# EAGLE board Calliope mini rev2.1 (EAGLE 9.6.2), part 1 of 2
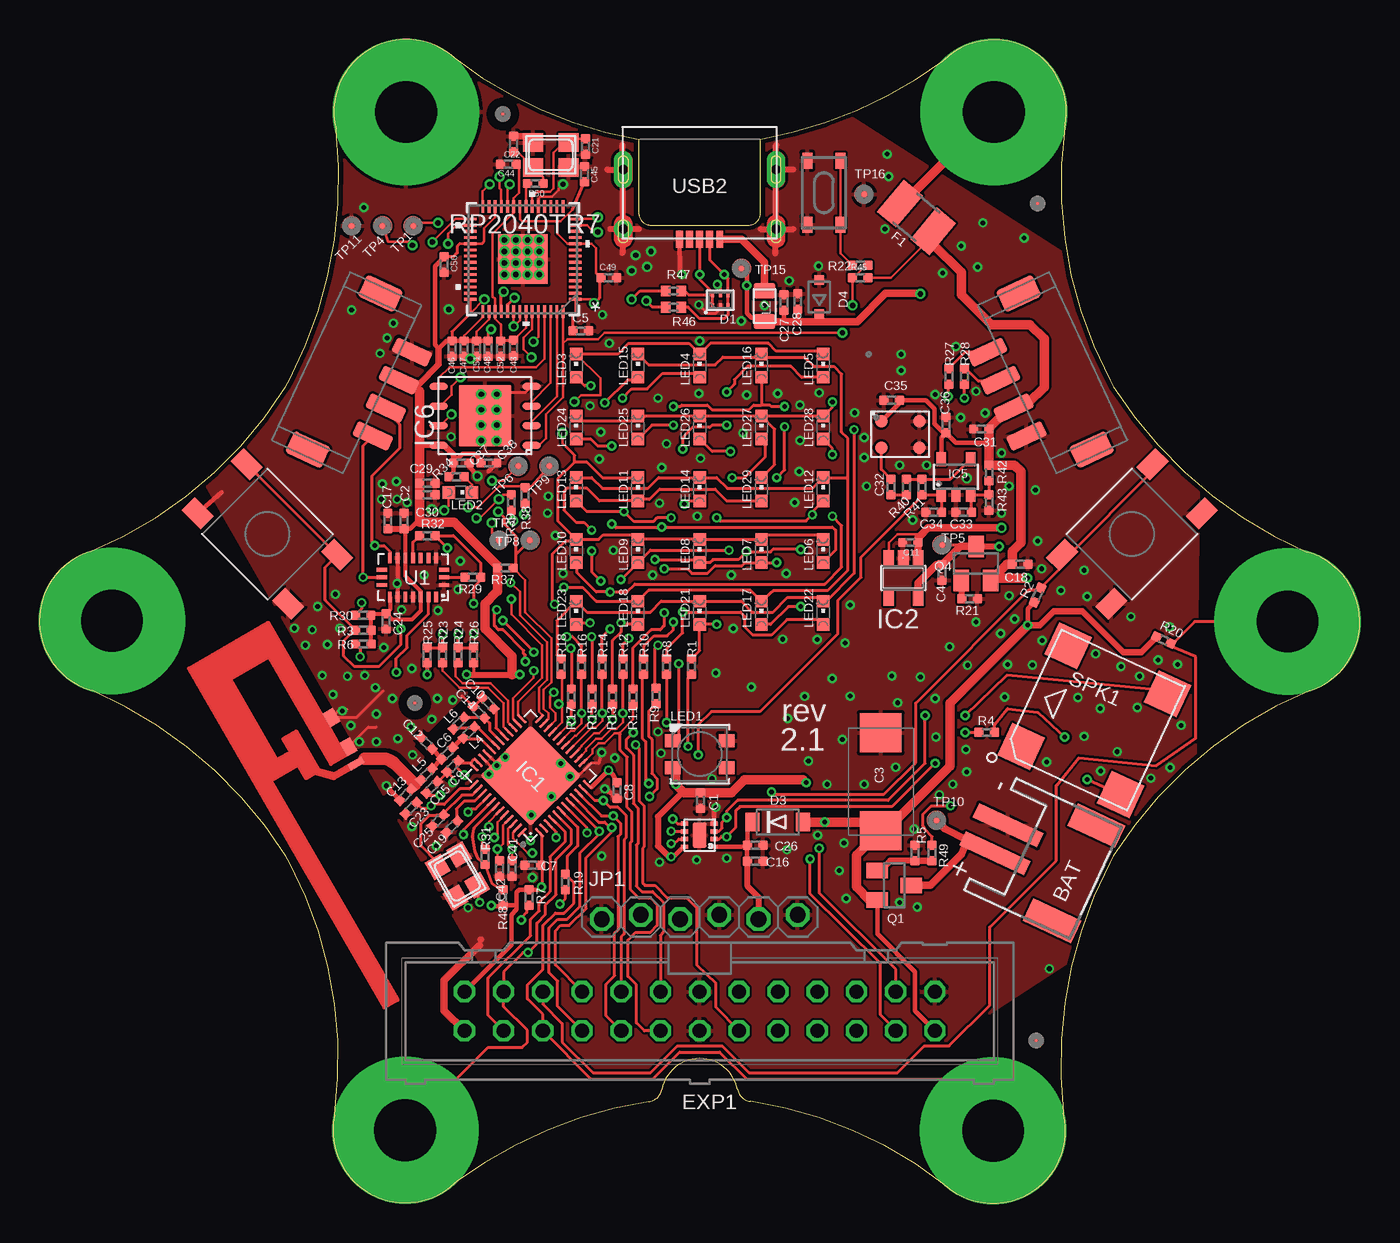
[diagram p3: board, top side]
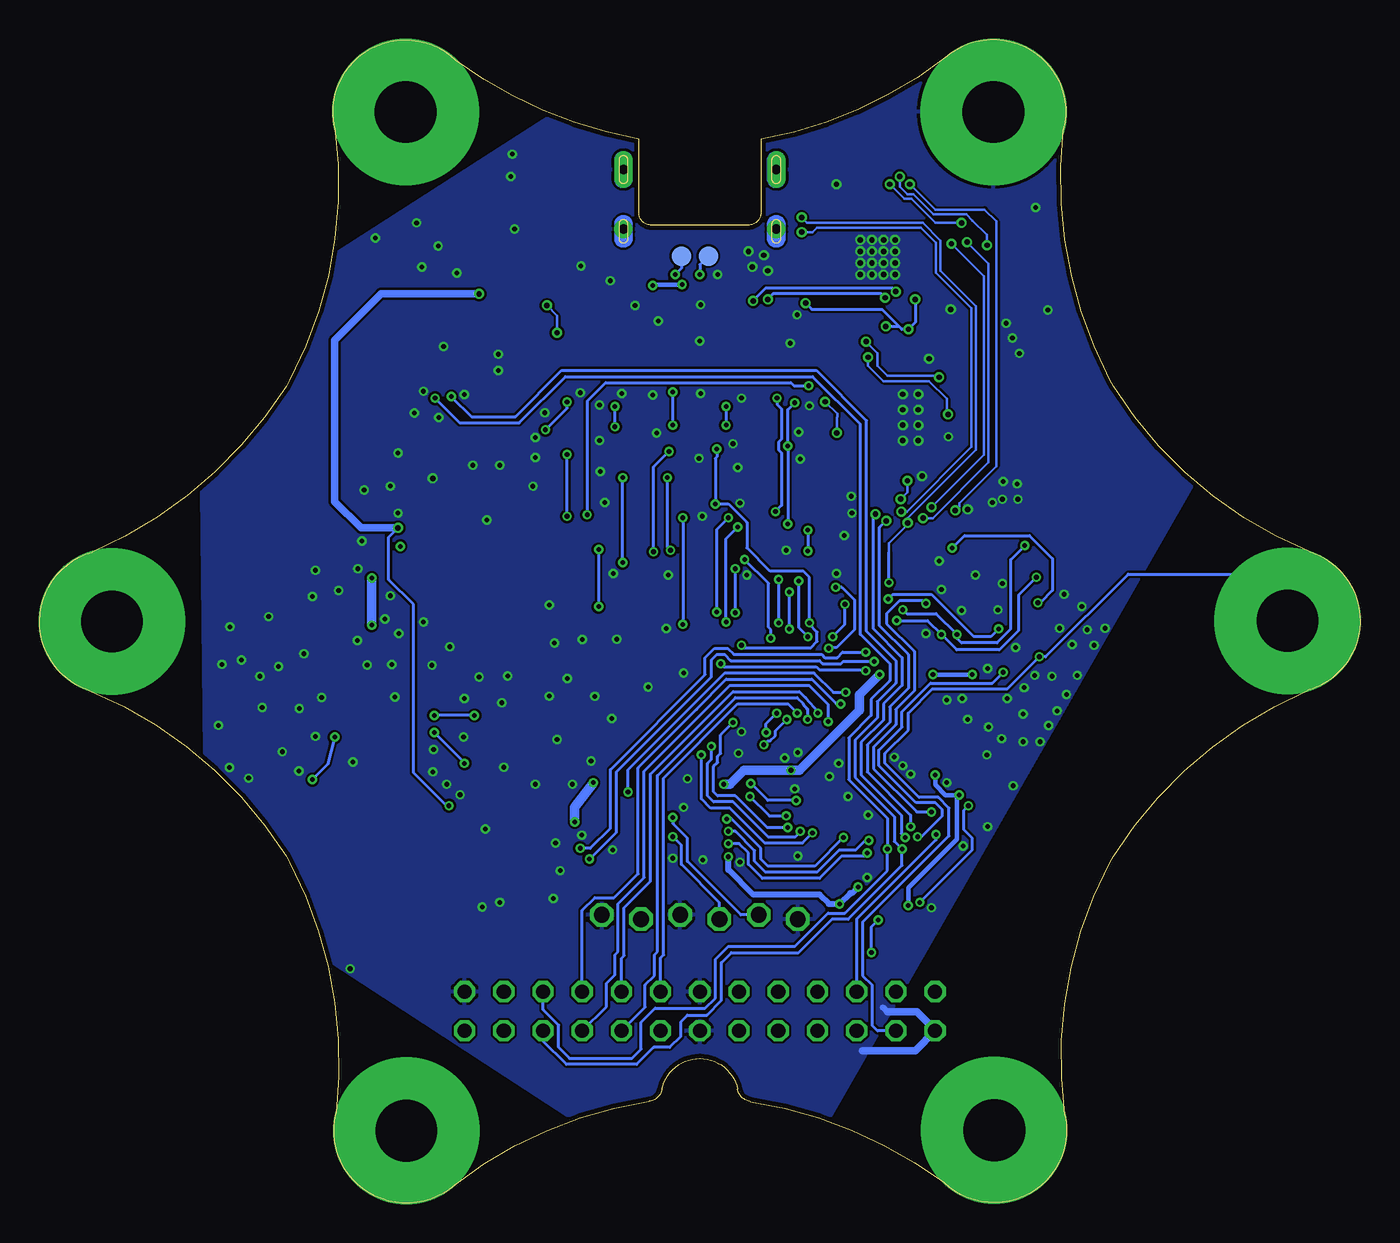
[diagram p4: board, bottom side, seen from below]

Size 85.54 x 75.36 mm. Coordinates in mm from the lower left corner, seen from the top.
Outline: 38.82,68.88 38.82,68.89
Outline: 46.72,64.13 arc-90 45.92,63.33 39.62,63.33 arc-90 38.82,64.13 38.82,68.89 arc-28 26.9,74.16 arc146 19.21,69.54 arc-34 16.21,53.31 15.96,52.87 arc-36 3.25,42.18 arc146 3.4,33.2 arc-34 15.96,22.5 16.21,22.05 arc-36 19.11,5.7 arc146 26.96,1.35 arc-28 39.49,6.57 arc70 40.32,7.36 arc-157 45.22,7.37 arc70 46.05,6.59 arc-29 58.64,1.2 arc146 66.33,5.83 arc-34 69.33,22.05 69.58,22.5 arc-36 82.3,33.18 arc146 82.14,42.16 arc-34 69.58,52.87 69.33,53.31 arc-36 66.43,69.66 arc146 58.58,74.01 arc-26 46.72,68.9 46.72,68.88
Copper layers (1*16): Top 0.035mm / dielectric 1.55mm / Bottom 0.035mm
Design rules "eC_2Layer_PClass6_BaseCopperO35 *": minimum track width 0.15mm, minimum drill 0.3mm, track to track 0.15mm, track to pad 0.15mm, pad to pad 0.15mm, via to via 0.15mm, smd to smd 0mil, copper to edge 0.3mm, drill to drill 0.35mm, minimum pad ring 0.175mm, minimum via ring 0.15mm, stop-mask expansion 0.05mm, vias tented up to drill 0.45mm, thermal gap 0.2mm
tKeepout: area 18,64.9 to 29.5,76.4; area 56.1,64.9 to 67.6,76.4; area 75.1,31.9 to 86.6,43.4; area 56,-1.1 to 67.5,10.4; area 18,-1 to 29.5,10.5; area 35.8,63.9 to 37.8,69.9; area 35.8,62.5 to 37.8,68.5; area 35.8,60.5 to 41.8,62.5; area 41.8,60.5 to 47.8,62.5; area 47.8,60.5 to 49.8,66.5; area 47.8,64.5 to 49.8,70.5; area 48.1,67.7 to 54.1,69.7; area 52.2,63.7 to 54.2,69.7; area 52.2,63.1 to 54.2,69.1; area 48.2,61.1 to 54.2,63.1; area 66.1,23.7 to 72.4,28.1; area 63,25.1 to 69.3,29.5; area 59.6,24.1 to 63.9,30.4; area 57.8,20.4 to 62.2,26.7; area 57,16.9 to 63.3,21.3; area 61.7,14.7 to 68,19.1; area 22.5,5.7 to 28.5,7.7; area 28.5,5.7 to 34.5,7.7; area 34.5,5.7 to 40.5,7.7; area 40.5,5.7 to 46.5,7.7; area 46.5,5.7 to 52.5,7.7; area 52.5,5.7 to 58.5,7.7; area 57.1,5.7 to 63.1,7.7; area 63.1,5.7 to 65.1,11.7; area 63.1,11.7 to 65.1,17.7; area 59.1,16.9 to 65.1,18.9; area 53.1,16.9 to 59.1,18.9; area 47.1,16.9 to 53.1,18.9; area 41.1,16.9 to 47.1,18.9; area 35.1,16.9 to 41.1,18.9; area 29.1,16.9 to 35.1,18.9; area 23.1,16.9 to 29.1,18.9; area 22.4,16.9 to 28.4,18.9; area 20.4,12.9 to 22.4,18.9; area 20.4,6.9 to 22.4,12.9; area 43.1,19.8 to 49.1,21.8; area 49.1,15.8 to 51.1,21.8; area 37.1,19.8 to 43.1,21.8; area 36.4,19.8 to 42.4,21.8; area 34.4,15.8 to 36.4,21.8; area 14.8,37.7 to 20.4,43.4; area 66.5,36.3 to 72.2,41.9; area 70.8,37.7 to 76.4,43.3; area 67.5,46.2 to 73.8,50.6; area 64.1,44.6 to 70.4,49; area 61.5,46.4 to 65.9,52.7; area 59.7,50.2 to 64.1,56.5; area 59,51.8 to 63.3,58.1; area 58.1,57.3 to 64.4,61.6; area 60.8,58.5 to 67.1,62.9; area 65.1,37.7 to 70.8,43.3; area 63.7,41.9 to 69.4,47.6; area 67.5,45.8 to 73.2,51.4; area 73.1,40.1 to 78.8,45.7; area 16.2,42 to 21.8,47.6; area 12.4,45.7 to 18.1,51.4; area 10.5,36.3 to 16.2,42; area 6.6,40.3 to 12.2,45.9; area 19.6,46.4 to 24,52.7; area 15.2,44.6 to 21.5,48.9; area 22.2,51.8 to 26.5,58.1; area 21.1,57.3 to 27.4,61.7; area 18.5,58.6 to 24.8,62.9; area -1,31.9 to 10.5,43.4

## Footprints (pad centres in the part's own frame; a part is rotated, then mirrored left to right if it is on the bottom)
JST-PH-2-SMT-RA = smd 1 x 4.6: 1 1,-3.7; 2 -1,-3.7 | smd 1.6 x 3.4: NC1 -3.4,1.5; NC2 3.4,1.5
0402 = smd 0.6 x 0.6: 1 -0.5,0; 2 0.5,0
D/7343-31R = smd 2.55 x 2.7: + 3.175,0; - -3.175,0
SOT886 = smd 0.325 x 0.27: 1 -0.338,0.5; 2 -0.338,0; 3 -0.338,-0.5; 4 0.338,-0.5; 5 0.338,0; 6 0.338,0.5
SOD-123FL = smd 0.91 x 1.22: A 1.637,0; C -1.637,0
SOD323-R = smd 0.6 x 0.6: A 1.1,0; C -1.1,0
ML26 = drill 0.914 octagon: 1 -15.24,-1.27; 2 -15.24,1.27; 3 -12.7,-1.27; 4 -12.7,1.27; 5 -10.16,-1.27; 6 -10.16,1.27; 7 -7.62,-1.27; 8 -7.62,1.27; 9 -5.08,-1.27; 10 -5.08,1.27; 11 -2.54,-1.27; 12 -2.54,1.27; 13 0,-1.27; 14 0,1.27; 15 2.54,-1.27; 16 2.54,1.27; 17 5.08,-1.27; 18 5.08,1.27; 19 7.62,-1.27; 20 7.62,1.27; 21 10.16,-1.27; 22 10.16,1.27; 23 12.7,-1.27; 24 12.7,1.27; 25 15.24,-1.27; 26 15.24,1.27
R1210 = smd 1.6 x 2.7: 1 -1.4,0; 2 1.4,0
1125S-SMT-XP = smd 1 x 2.5: 1 3,0.325; 2 1,0.325; 3 -1,0.325; 4 -3,0.325 | smd 1.55 x 2.6: P$1 5.575,-3.125; P$2 -5.575,-3.125
QFN48 = smd 0.8 x 0.2: 1 -3,2.2; 2 -3,1.8; 3 -3,1.4; 4 -3,1; 5 -3,0.6; 6 -3,0.2; 7 -3,-0.2; 8 -3,-0.6; 9 -3,-1; 10 -3,-1.4; 11 -3,-1.8; 12 -3,-2.2; 25 3,-2.2; 26 3,-1.8; 27 3,-1.4; 28 3,-1; 29 3,-0.6; 30 3,-0.2; 31 3,0.2; 32 3,0.6; 33 3,1; 34 3,1.4; 35 3,1.8; 36 3,2.2 | smd 0.2 x 0.8: 13 -2.2,-3; 14 -1.8,-3; 15 -1.4,-3; 16 -1,-3; 17 -0.6,-3; 18 -0.2,-3; 19 0.2,-3; 20 0.6,-3; 21 1,-3; 22 1.4,-3; 23 1.8,-3; 24 2.2,-3; 37 2.2,3; 38 1.8,3; 39 1.4,3; 40 1,3; 41 0.6,3; 42 0.2,3; 43 -0.2,3; 44 -0.6,3; 45 -1,3; 46 -1.4,3; 47 -1.8,3; 48 -2.2,3 | smd 4.65 x 4.65: GND 0,0
SOT23-5 = smd 0.69 x 0.99: 1 -0.95,-1.29; 2 0,-1.29; 3 0.95,-1.29; 4 0.95,1.3; 5 -0.95,1.3
WSON8 = smd 0.28 x 0.5: 1 -0.75,-0.925; 2 -0.25,-0.925; 3 0.25,-0.925; 4 0.75,-0.925; 5 0.75,0.975; 6 0.25,0.975; 7 -0.25,0.975; 8 -0.75,0.975 | smd 1.6 x 0.9: EP 0,0
SOT23-5' = smd 0.6 x 0.9: 1 -0.95,-1.15; 2 0,-1.15; 3 0.95,-1.15; 4 0.95,1.15; 5 -0.95,1.15
VQFN8_6X5 = smd 1.2 x 0.45: 1 -3,1.905; 2 -3,0.635; 3 -3,-0.635; 4 -3,-1.905; 5 3,-1.905; 6 3,-0.635; 7 3,0.635; 8 3,1.905 | smd 3.4 x 4: EP 0,0
1X06-OFF = drill 1.016 octagon: 1 -6.35,-0.14; 2 -3.81,0.14; 3 -1.27,-0.14; 4 1.27,0.14; 5 3.81,-0.14; 6 6.35,0.14
FERRIT_0805 = smd 1 x 1.4: 1 -1,0; 2 1,0
LED3535 = smd 1 x 0.85: 1 -1.75,0.875; 2 -1.75,-0.875; 3 1.75,-0.875; 4 1.75,0.875
CHIPLED_0603 = smd 0.8 x 0.8: A 0,-0.75; C 0,0.75
SPU0410HR5H-PB = smd 0.8 x 0.8: 1 0.85,1.23; 2 0.85,-1.23; 3 -0.85,-1.23; 4 -0.85,1.23
BANANA_REC = drill 4 pad 9.5: 1 0,0
SOT23 = smd 1 x 1.4: 1 -0.95,-1.1; 2 0.95,-1.1; 3 0,1.1
NX3225 = smd 1.3 x 1.2: 1 -1.15,-0.8; 2 1.15,-0.8; 3 1.15,0.8; 4 -1.15,0.8
R0402 = smd 0.6 x 0.7: 1 -0.5,0; 2 0.5,0
MLT-8530 = smd 2.3 x 2.3: +LEAD -3.575,3.65; -LEAD -3.575,-3.55; DUMMY1 3.575,3.55; DUMMY2 3.575,-3.65
PTS645S = smd 1.74 x 1.2: 1 -4.145,2.25; 2 4.145,2.25; 3 -4.145,-2.25; 4 4.145,-2.25
PTS810 = smd 1.05 x 0.65: 1 -2.075,1.075; 2 2.075,1.075; 3 -2.075,-1.075; 4 2.075,-1.075
B1,27 = smd 1.27 x 1.27: TP 0,0
BMX055 = smd 0.675 x 0.25: 1 1.262,1.5; 2 1.262,1; 3 1.262,0.5; 4 1.262,0; 5 1.262,-0.5; 6 1.262,-1; 7 1.262,-1.5; 11 -1.262,-1.5; 12 -1.262,-1; 13 -1.262,-0.5; 14 -1.262,0; 15 -1.262,0.5; 16 -1.262,1; 17 -1.262,1.5 | smd 0.25 x 0.675: 8 0.5,-2.013; 9 0,-2.013; 10 -0.5,-2.013; 18 -0.5,2.013; 19 0,2.013; 20 0.5,2.013
RP2040TR7_RPI = smd 0.813 x 0.178: 1 -3.404,2.6; 2 -3.404,2.2; 3 -3.404,1.8; 4 -3.404,1.4; 5 -3.404,1; 6 -3.404,0.6; 7 -3.404,0.2; 8 -3.404,-0.2; 9 -3.404,-0.6; 10 -3.404,-1; 11 -3.404,-1.4; 12 -3.404,-1.8; 13 -3.404,-2.2; 14 -3.404,-2.6; 29 3.404,-2.6; 30 3.404,-2.2; 31 3.404,-1.8; 32 3.404,-1.4; 33 3.404,-1; 34 3.404,-0.6; 35 3.404,-0.2; 36 3.404,0.2; 37 3.404,0.6; 38 3.404,1; 39 3.404,1.4; 40 3.404,1.8; 41 3.404,2.2; 42 3.404,2.6 | smd 0.178 x 0.813: 15 -2.6,-3.404; 16 -2.2,-3.404; 17 -1.8,-3.404; 18 -1.4,-3.404; 19 -1,-3.404; 20 -0.6,-3.404; 21 -0.2,-3.404; 22 0.2,-3.404; 23 0.6,-3.404; 24 1,-3.404; 25 1.4,-3.404; 26 1.8,-3.404; 27 2.2,-3.404; 28 2.6,-3.404; 43 2.6,3.404; 44 2.2,3.404; 45 1.8,3.404; 46 1.4,3.404; 47 1,3.404; 48 0.6,3.404; 49 0.2,3.404; 50 -0.2,3.404; 51 -0.6,3.404; 52 -1,3.404; 53 -1.4,3.404; 54 -1.8,3.404; 55 -2.2,3.404; 56 -2.6,3.404 | smd 3.2 x 3.2: 57 0,0
DN0007+0_MIRROR = smd 0.46 x 1 bottom: FEED 2.22,-2.8 | smd 1.01 x 0.74 bottom: GND -1.16,-2.93; GND@1 1.035,-2.93
FIDUCIAL_1MM = smd 1 x 1: 1 0,0
47642-0001 = smd 0.45 x 1.1: 1 -1.3,6.47; 2 -0.65,6.47; 3 0,6.47; 4 0.65,6.47; 5 1.3,6.47 | drill 0.6 pad 1.2 long: P$1 -4.95,1.95; P$3 4.95,1.95 | drill 0.6 pad 1.2: P$2 -4.95,5.8; P$4 4.95,5.8

## Placement (x,y rotation side)
BAT  S2B-PH-SM4-TB(LF)(SN)  [JST-PH-2-SMT-RA]  65.68,22 245 top
C1  100nF/25V/10%  [0402]  42.82,26.08 270 top
C2  10uF/16V/10%  [0402]  23.62,44.18 90 top
C3  100uF/6,3V/10%  [D/7343-31R]  54.5,27.29 270 top
C4  10uF/16V/10%  [0402]  58.47,40.83 270 top
C5  100nF/25V/10%  [0402]  35.07,56.48 0 top
C6  2,2pF/50V  [0402]  26.42,29.13 225 top
C7  100nF/25V/10%  [0402]  31.97,21.88 180 top
C8  100nF/25V/10%  [0402]  37.42,26.73 270 top
C9  1nF/25V/5%  [0402]  26.77,28.28 225 top
C10  47nF/25V/10%  [0402]  29.07,32.38 135 top
C11  1uF/16V/10%  [0402]  56.42,42.78 180 top
C12  1,0pF/50V  [0402]  25.07,29.78 135 top
C13  1,5pF/50V  [0402]  23.72,26.43 225 top
C14  2,2nF/25V/5%  [0402]  28.47,31.78 135 top
C15  100nF/25V/10%  [0402]  25.42,26.93 45 top
C16  100nF/25V/10%  [0402]  46.37,22.13 0 top
C17  100nF/25V/10%  [0402]  22.57,44.18 90 top
C18  100nF/25V/10%  [0402]  63.52,41.38 0 top
C19  100nF/25V/10%  [0402]  26.72,24.38 225 top
C21  27pF/50V/1%  [0402]  35.37,68.43 270 top
C22  27pF/50V/1%  [0402]  30.72,68.58 90 top
C23  12pF/50V/1%  [0402]  24.07,25.58 225 top
C24  100nF/25V/10%  [0402]  22.47,37.68 270 top
C25  12pF/50V/1%  [0402]  25.82,24.78 225 top
C26  10uF/16V/10%  [0402]  46.37,23.18 0 top
C27  10uF/16V/10%  [0402]  48.22,58.33 90 top
C28  100nF/25V/10%  [0402]  49.12,58.38 90 top
C29  10uF/16V/10%  [0402]  25.12,46.63 0 top
C30  100nF/25V/10%  [0402]  25.12,45.88 0 top
C31  100nF/25V/10%  [0402]  61.02,50.13 180 top
C32  100nF/25V/10%  [0402]  55.17,46.38 90 top
C33  100nF/25V/10%  [0402]  59.87,44.73 180 top
C34  100nF/25V/10%  [0402]  57.92,44.73 180 top
C35  100nF/25V/10%  [0402]  55.22,51.98 180 top
C36  100nF/25V/10%  [0402]  58.72,50.38 90 top
C37  100nF/25V/10%  [0402]  27.32,47.93 0 top
C38  10uF/16V/10%  [0402]  29.12,47.93 0 top
C41  100nF/25V/10%  [0402]  30.62,21.68 270 top
C42  100nF/25V/10%  [0402]  29.82,21.68 270 top
C43  100nF/25V/10%  [0402]  30.72,55.38 270 top
C44  100nF/25V/10%  [0402]  30.37,67.28 180 top
C45  100nF/25V/10%  [0402]  35.32,66.63 90 top
C46  100nF/25V/10%  [0402]  26.72,55.33 270 top
C47  100nF/25V/10%  [0402]  27.52,55.33 270 top
C48  100nF/25V/10%  [0402]  29.07,55.33 270 top
C49  100nF/25V/10%  [0402]  36.87,59.93 0 top
C50  100nF/25V/10%  [0402]  26.22,60.78 270 top
C51  1uF/16V/10%  [0402]  28.32,55.33 270 top
C52  1uF/16V/10%  [0402]  29.87,55.33 270 top
D1  PRTR5V0U2F  [SOT886]  44.11,58.47 90 top
D3  MBR1020VL  [SOD-123FL]  47.82,24.68 0 top
D4  [SOD323-R]  50.52,58.68 90 top
EXP1  [ML26]  42.77,12.43 180 top
F1  MICROSMDCH050F-02  [R1210]  56.82,63.83 140 top
I2C  1125S-SMT-XP  [1125S-SMT-XP]  22.57,52.53 245 top
IC1  NRF51822  [QFN48]  31.82,27.68 135 top
IC2  R1131N331DSOT23-5  [SOT23-5]  55.97,40.48 180 top
IC3  DRV8837  [WSON8]  42.77,23.83 90 top
IC5  MCP6001  [SOT23-5']  59.37,47.03 0 top
IC6  IS25LP128F  [VQFN8_6X5]  28.87,50.98 180 top
JP1  [1X06-OFF]  42.77,18.53 0 top
L2  MH2029-800Y  [FERRIT_0805]  46.98,58.09 270 top
L4  4,7nH  [0402]  27.82,30.48 45 top
L5  3,3nH  [0402]  25.07,27.78 225 top
L6  10nH  [0402]  27.17,31.08 225 top
LED1  SK6812MINI  [LED3535]  42.77,29.08 0 top
LED2  gelb  [CHIPLED_0603]  27.27,46.03 270 top
LED3  rot  [CHIPLED_0603]  34.77,54.23 0 top
LED4  rot  [CHIPLED_0603]  42.77,54.23 0 top
LED5  rot  [CHIPLED_0603]  50.77,54.23 0 top
LED6  rot  [CHIPLED_0603]  50.77,42.23 0 top
LED7  rot  [CHIPLED_0603]  46.77,42.23 0 top
LED8  rot  [CHIPLED_0603]  42.77,42.23 0 top
LED9  rot  [CHIPLED_0603]  38.77,42.23 0 top
LED10  rot  [CHIPLED_0603]  34.77,42.23 0 top
LED11  rot  [CHIPLED_0603]  38.77,46.23 0 top
LED12  rot  [CHIPLED_0603]  50.77,46.23 0 top
LED13  rot  [CHIPLED_0603]  34.77,46.23 0 top
LED14  rot  [CHIPLED_0603]  42.77,46.23 0 top
LED15  rot  [CHIPLED_0603]  38.77,54.23 0 top
LED16  rot  [CHIPLED_0603]  46.77,54.23 0 top
LED17  rot  [CHIPLED_0603]  46.77,38.23 0 top
LED18  rot  [CHIPLED_0603]  38.77,38.23 0 top
LED21  rot  [CHIPLED_0603]  42.77,38.23 0 top
LED22  rot  [CHIPLED_0603]  50.77,38.23 0 top
LED23  rot  [CHIPLED_0603]  34.77,38.23 0 top
LED24  rot  [CHIPLED_0603]  34.77,50.23 0 top
LED25  rot  [CHIPLED_0603]  38.77,50.23 0 top
LED26  rot  [CHIPLED_0603]  42.77,50.23 0 top
LED27  rot  [CHIPLED_0603]  46.77,50.23 0 top
LED28  rot  [CHIPLED_0603]  50.77,50.23 0 top
LED29  rot  [CHIPLED_0603]  46.77,46.23 0 top
MIC1  SPU0410HR5H-PB  [SPU0410HR5H-PB]  55.77,49.78 90 top
P_0  BANANA_PCB  [BANANA_REC]  4.7,37.71 0 top
P_1  BANANA_PCB  [BANANA_REC]  23.7,4.72 0 top
P_2  BANANA_PCB  [BANANA_REC]  61.78,4.69 0 top
P_3  BANANA_PCB  [BANANA_REC]  80.86,37.66 0 top
P_+3V  BANANA_PCB  [BANANA_REC]  61.84,70.65 0 top
P_GND  BANANA_PCB  [BANANA_REC]  23.75,70.66 0 top
Q1  DMG2305UX  [SOT23]  55.37,20.58 270 top
Q2  16.0 Mhz  [NX3225]  27.07,21.18 120 top
Q3  12.0 Mhz  [NX3225]  33.12,67.88 180 top
Q4  DMG2305UX  [SOT23]  60.67,41.43 0 top
R1  220R/1%  [0402]  42.24,34.74 90 top
R2  100K/1%  [0402]  64.66,39.39 245 top
R3  100K/1%  [0402]  20.98,37.09 0 top
R4  0R  [0402]  61.37,30.48 0 top
R5  680k/1%  [0402]  56.72,22.68 270 top
R6  3,3M/1%  [0402]  20.99,36.21 0 top
R7  3,3M/1%  [0402]  31.73,19.79 90 top
R8  220R/1%  [0402]  40.62,34.74 90 top
R9  220R/1%  [0402]  39.95,32.84 90 top
R10  220R/1%  [0402]  39.13,34.74 90 top
R11  220R/1%  [0402]  38.46,32.79 90 top
R12  220R/1%  [0402]  37.8,34.74 90 top
R13  220R/1%  [0402]  37.13,32.79 90 top
R14  220R/1%  [0402]  36.46,34.74 90 top
R15  220R/1%  [0402]  35.79,32.79 90 top
R16  0R  [0402]  35.12,34.74 90 top
R17  0R  [0402]  34.46,32.79 90 top
R18  0R  [0402]  33.79,34.74 90 top
R19  3,3M/1%  [0402]  34.07,20.79 270 top
R20  3,3M/1%  [0402]  72.83,36.47 155 top
R21  680k/1%  [0402]  60.27,39.13 180 top
R22  1K/1%  [0402]  53.17,60.73 0 top
R23  0R  [0402]  26.12,35.48 90 top
R24  0R  [0402]  27.12,35.48 90 top
R25  2,2K/1%  [0402]  25.12,35.48 270 top
R26  2,2K/1%  [0402]  28.12,35.48 270 top
R27  100R/1%  [0402]  58.92,53.53 90 top
R28  100R/1%  [0402]  59.92,53.53 90 top
R29  10K/1%  [0402]  28.07,40.53 180 top
R30  100K/1%  [0402]  20.97,38.08 0 top
R31  10K/1%  [0402]  28.87,22.43 270 top
R32  10K/1%  [0402]  25.12,43.23 180 top
R34  2,2K/1%  [0402]  27.02,47.03 180 top
R37  [0402]  30.17,41.13 180 top
R38  1K/5%  [0402]  31.47,45.83 270 top
R39  1K/5%  [0402]  30.57,45.38 270 top
R40  10K/1%  [0402]  56.17,46.38 270 top
R41  1M/1%  [0402]  57.17,46.38 90 top
R42  100K/1%  [0402]  61.52,47.28 90 top
R43  100K/1%  [0402]  61.52,45.38 90 top
R45  n.f.  [0402]  53.17,59.93 0 top
R46  10R/1%  [R0402]  41.08,58.02 180 top
R47  10R/1%  [R0402]  41.08,59.07 180 top
R48  100K/1%  [0402]  30.02,19.78 270 top
R49  390k/1%  [0402]  57.82,22.68 270 top
R50  1K/1%  [0402]  32.12,66.03 180 top
SERIAL  1125S-SMT-XP  [1125S-SMT-XP]  62.97,52.53 115 top
SPK1  MLT-8530  [MLT-8530]  68.34,31.28 155 top
TAST_A  PTS645S blue  [PTS645S]  14.77,43.33 135 top
TAST_B  PTS645S red  [PTS645S]  70.77,43.33 225 top
TAST_RESET  PTS810SJ  [PTS810]  50.82,65.43 90 top
TP1  PTR1B1,27  [B1,27]  24.22,63.28 270 top
TP4  PTR1B1,27  [B1,27]  22.22,63.28 270 top
TP5  PTR1B1,27  [B1,27]  58.47,42.63 180 top
TP6  PTR1B1,27  [B1,27]  31.02,47.73 0 top
TP7  PTR1B1,27  [B1,27]  29.77,42.93 0 top
TP8  PTR1B1,27  [B1,27]  31.77,42.93 0 top
TP9  PTR1B1,27  [B1,27]  33.02,47.73 0 top
TP10  PTR1B1,27  [B1,27]  58.12,24.78 0 top
TP11  PTR1B1,27  [B1,27]  20.22,63.28 0 top
TP13  PTR1B1,27  [B1,27]  42.22,61.33 0 bottom
TP14  PTR1B1,27  [B1,27]  43.97,61.33 0 bottom
TP15  PTR1B1,27  [B1,27]  45.47,60.53 90 top
TP16  PTR1B1,27  [B1,27]  53.42,65.33 0 top
U1  BMX055  [BMX055]  24.2,40.53 270 top
U2  RP2040TR7  [RP2040TR7_RPI]  31.32,61.13 180 top
U$2  INVERTED_F_ANTENNA  [DN0007+0_MIRROR]  16.97,28.98 240 bottom
U$5  FIDUCIAL  [FIDUCIAL_1MM]  64.57,10.53 0 top
U$6  FIDUCIAL  [FIDUCIAL_1MM]  30.02,70.53 0 top
U$7  FIDUCIAL  [FIDUCIAL_1MM]  64.67,64.73 0 top
U$8  FIDUCIAL  [FIDUCIAL_1MM]  24.32,32.38 0 top
USB2  47642-0001  [47642-0001]  42.77,68.88 180 top